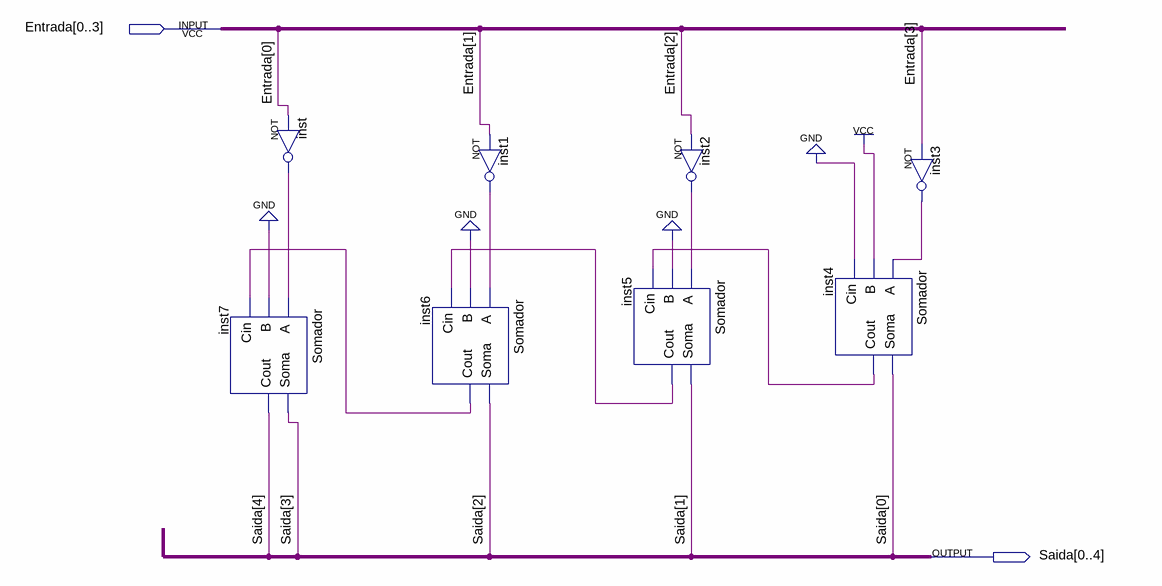
[diagram p0: schematic sheet]
// Quartus schematic complementa2.bdf as structural Verilog: 8 symbols, 2 pins
module complementa2 (
  input  [0:3] Entrada,
  output [0:4] Saida
);

  wire inst1_out, inst2_out, inst3_out, inst4_cout, inst5_cout, inst6_cout, inst_out;

  Somador inst7 (.A(inst_out), .B(1'b0), .Cin(inst6_cout), .Soma(Saida[3]), .Cout(Saida[4]));
  not inst (inst_out, Entrada[0]);
  Somador inst6 (.A(inst1_out), .B(1'b0), .Cin(inst5_cout), .Soma(Saida[2]), .Cout(inst6_cout));
  not inst1 (inst1_out, Entrada[1]);
  Somador inst5 (.A(inst2_out), .B(1'b0), .Cin(inst4_cout), .Soma(Saida[1]), .Cout(inst5_cout));
  not inst2 (inst2_out, Entrada[2]);
  Somador inst4 (.A(inst3_out), .B(1'b1), .Cin(1'b0), .Soma(Saida[0]), .Cout(inst4_cout));
  not inst3 (inst3_out, Entrada[3]);
endmodule
